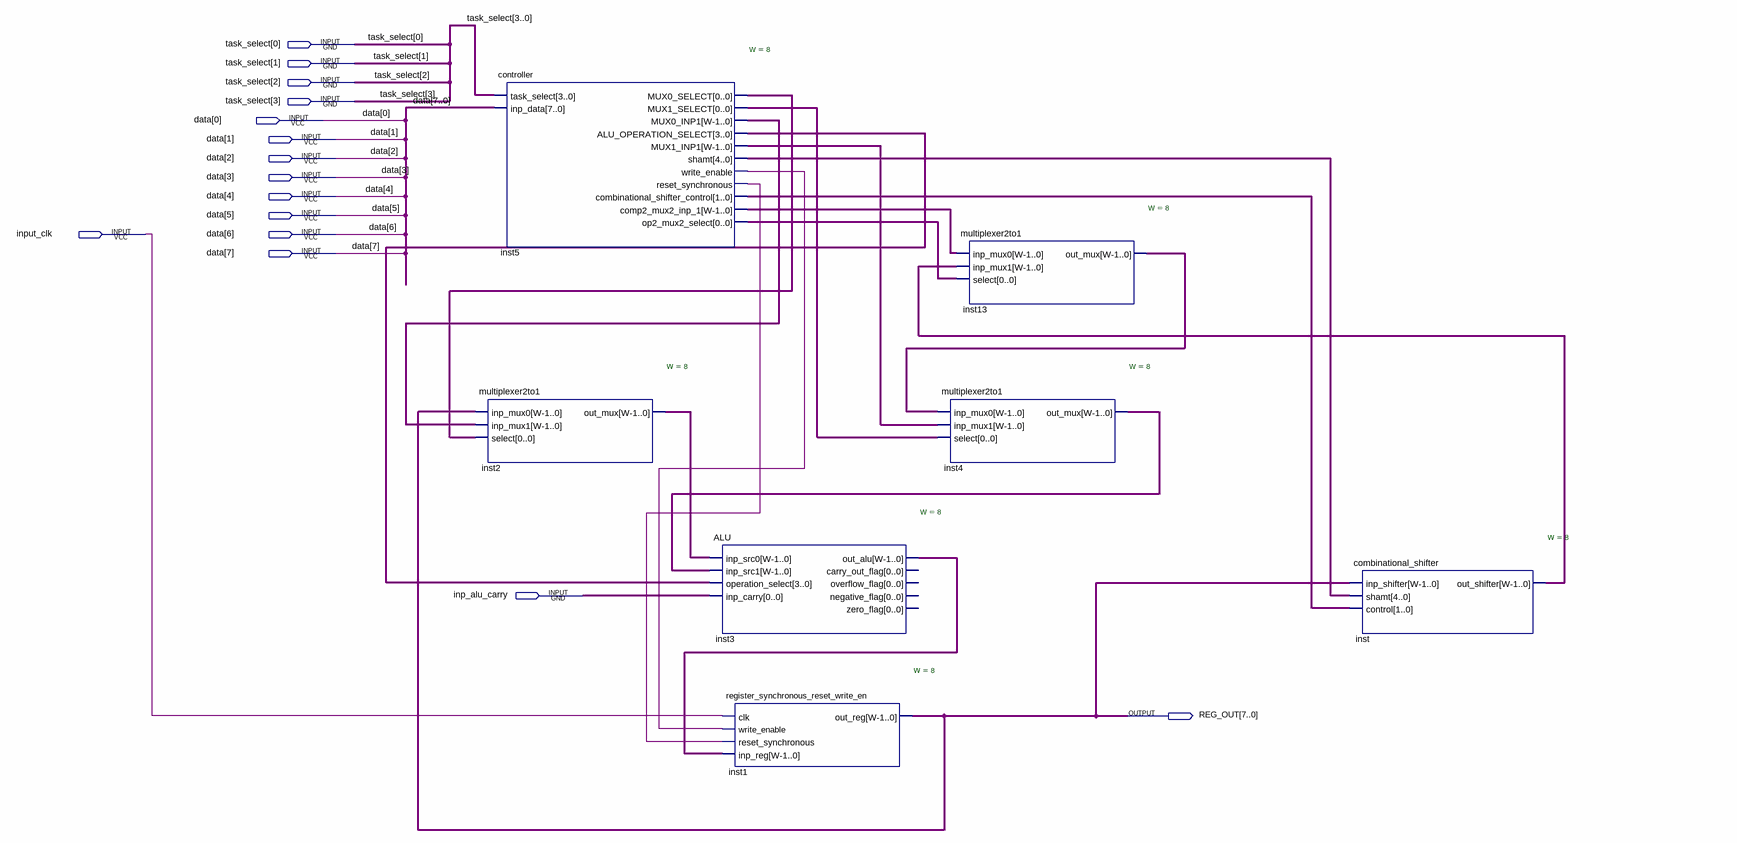
[diagram p0: schematic sheet]
// Quartus schematic data_path.bdf as structural Verilog: 7 symbols, 15 pins
module data_path (
  input  [3:0] task_select,
  input  [7:0] data,
  input  input_clk,
  input  inp_alu_carry,
  output [7:0] REG_OUT
);

  wire inst5_mux0_select, inst5_mux1_select, inst5_op2_mux2_select, inst5_reset_synchronous,
       inst5_write_enable;
  wire [1:0] inst5_combinational_shifter_control;
  wire [3:0] inst5_alu_operation_select;
  wire [4:0] inst5_shamt;
  wire [7:0] inst2_out_mux, inst3_out_alu, inst4_out_mux, inst5_comp2_mux2_inp_1, inst5_mux0_inp1,
       inst5_mux1_inp1, inst13_out_mux, inst_out_shifter;

  controller #(.W(8)) inst5 (
    .task_select(task_select), .inp_data(data), .MUX0_SELECT(inst5_mux0_select),
    .MUX1_SELECT(inst5_mux1_select), .MUX0_INP1(inst5_mux0_inp1),
    .ALU_OPERATION_SELECT(inst5_alu_operation_select), .MUX1_INP1(inst5_mux1_inp1), .shamt(inst5_shamt),
    .write_enable(inst5_write_enable), .reset_synchronous(inst5_reset_synchronous),
    .combinational_shifter_control(inst5_combinational_shifter_control),
    .comp2_mux2_inp_1(inst5_comp2_mux2_inp_1), .op2_mux2_select(inst5_op2_mux2_select));
  multiplexer2to1 #(.W(8)) inst2 (
    .inp_mux0(REG_OUT), .inp_mux1(inst5_mux0_inp1), .select(inst5_mux0_select), .out_mux(inst2_out_mux));
  ALU #(.W(8)) inst3 (
    .inp_src0(inst2_out_mux), .inp_src1(inst4_out_mux), .operation_select(inst5_alu_operation_select),
    .inp_carry(inp_alu_carry), .out_alu(inst3_out_alu));  // open: carry_out_flag, overflow_flag, negative_flag, zero_flag
  register_synchronous_reset_write_en #(.W(8)) inst1 (
    .clk(input_clk), .write_enable(inst5_write_enable), .reset_synchronous(inst5_reset_synchronous),
    .inp_reg(inst3_out_alu), .out_reg(REG_OUT));
  multiplexer2to1 #(.W(8)) inst4 (
    .inp_mux0(inst13_out_mux), .inp_mux1(inst5_mux1_inp1), .select(inst5_mux1_select), .out_mux(inst4_out_mux));
  multiplexer2to1 #(.W(8)) inst13 (
    .inp_mux0(inst5_comp2_mux2_inp_1), .inp_mux1(inst_out_shifter), .select(inst5_op2_mux2_select),
    .out_mux(inst13_out_mux));
  combinational_shifter #(.W(8)) inst (
    .inp_shifter(REG_OUT), .shamt(inst5_shamt), .control(inst5_combinational_shifter_control),
    .out_shifter(inst_out_shifter));
endmodule
